# EasyEDA Pro project 产品板v3.1.eprj

# Schematic Schematic1

## Sheets
1 主控: Board Name: Board1; Create Date: 2025-03-01; Page Name: 主控; Project Name: 产品板v3.1; Schematic Name: Schematic1; Update Date: 2025-10-28; Company: 嘉立创EDA; Page Size: A4; Version: V1.0
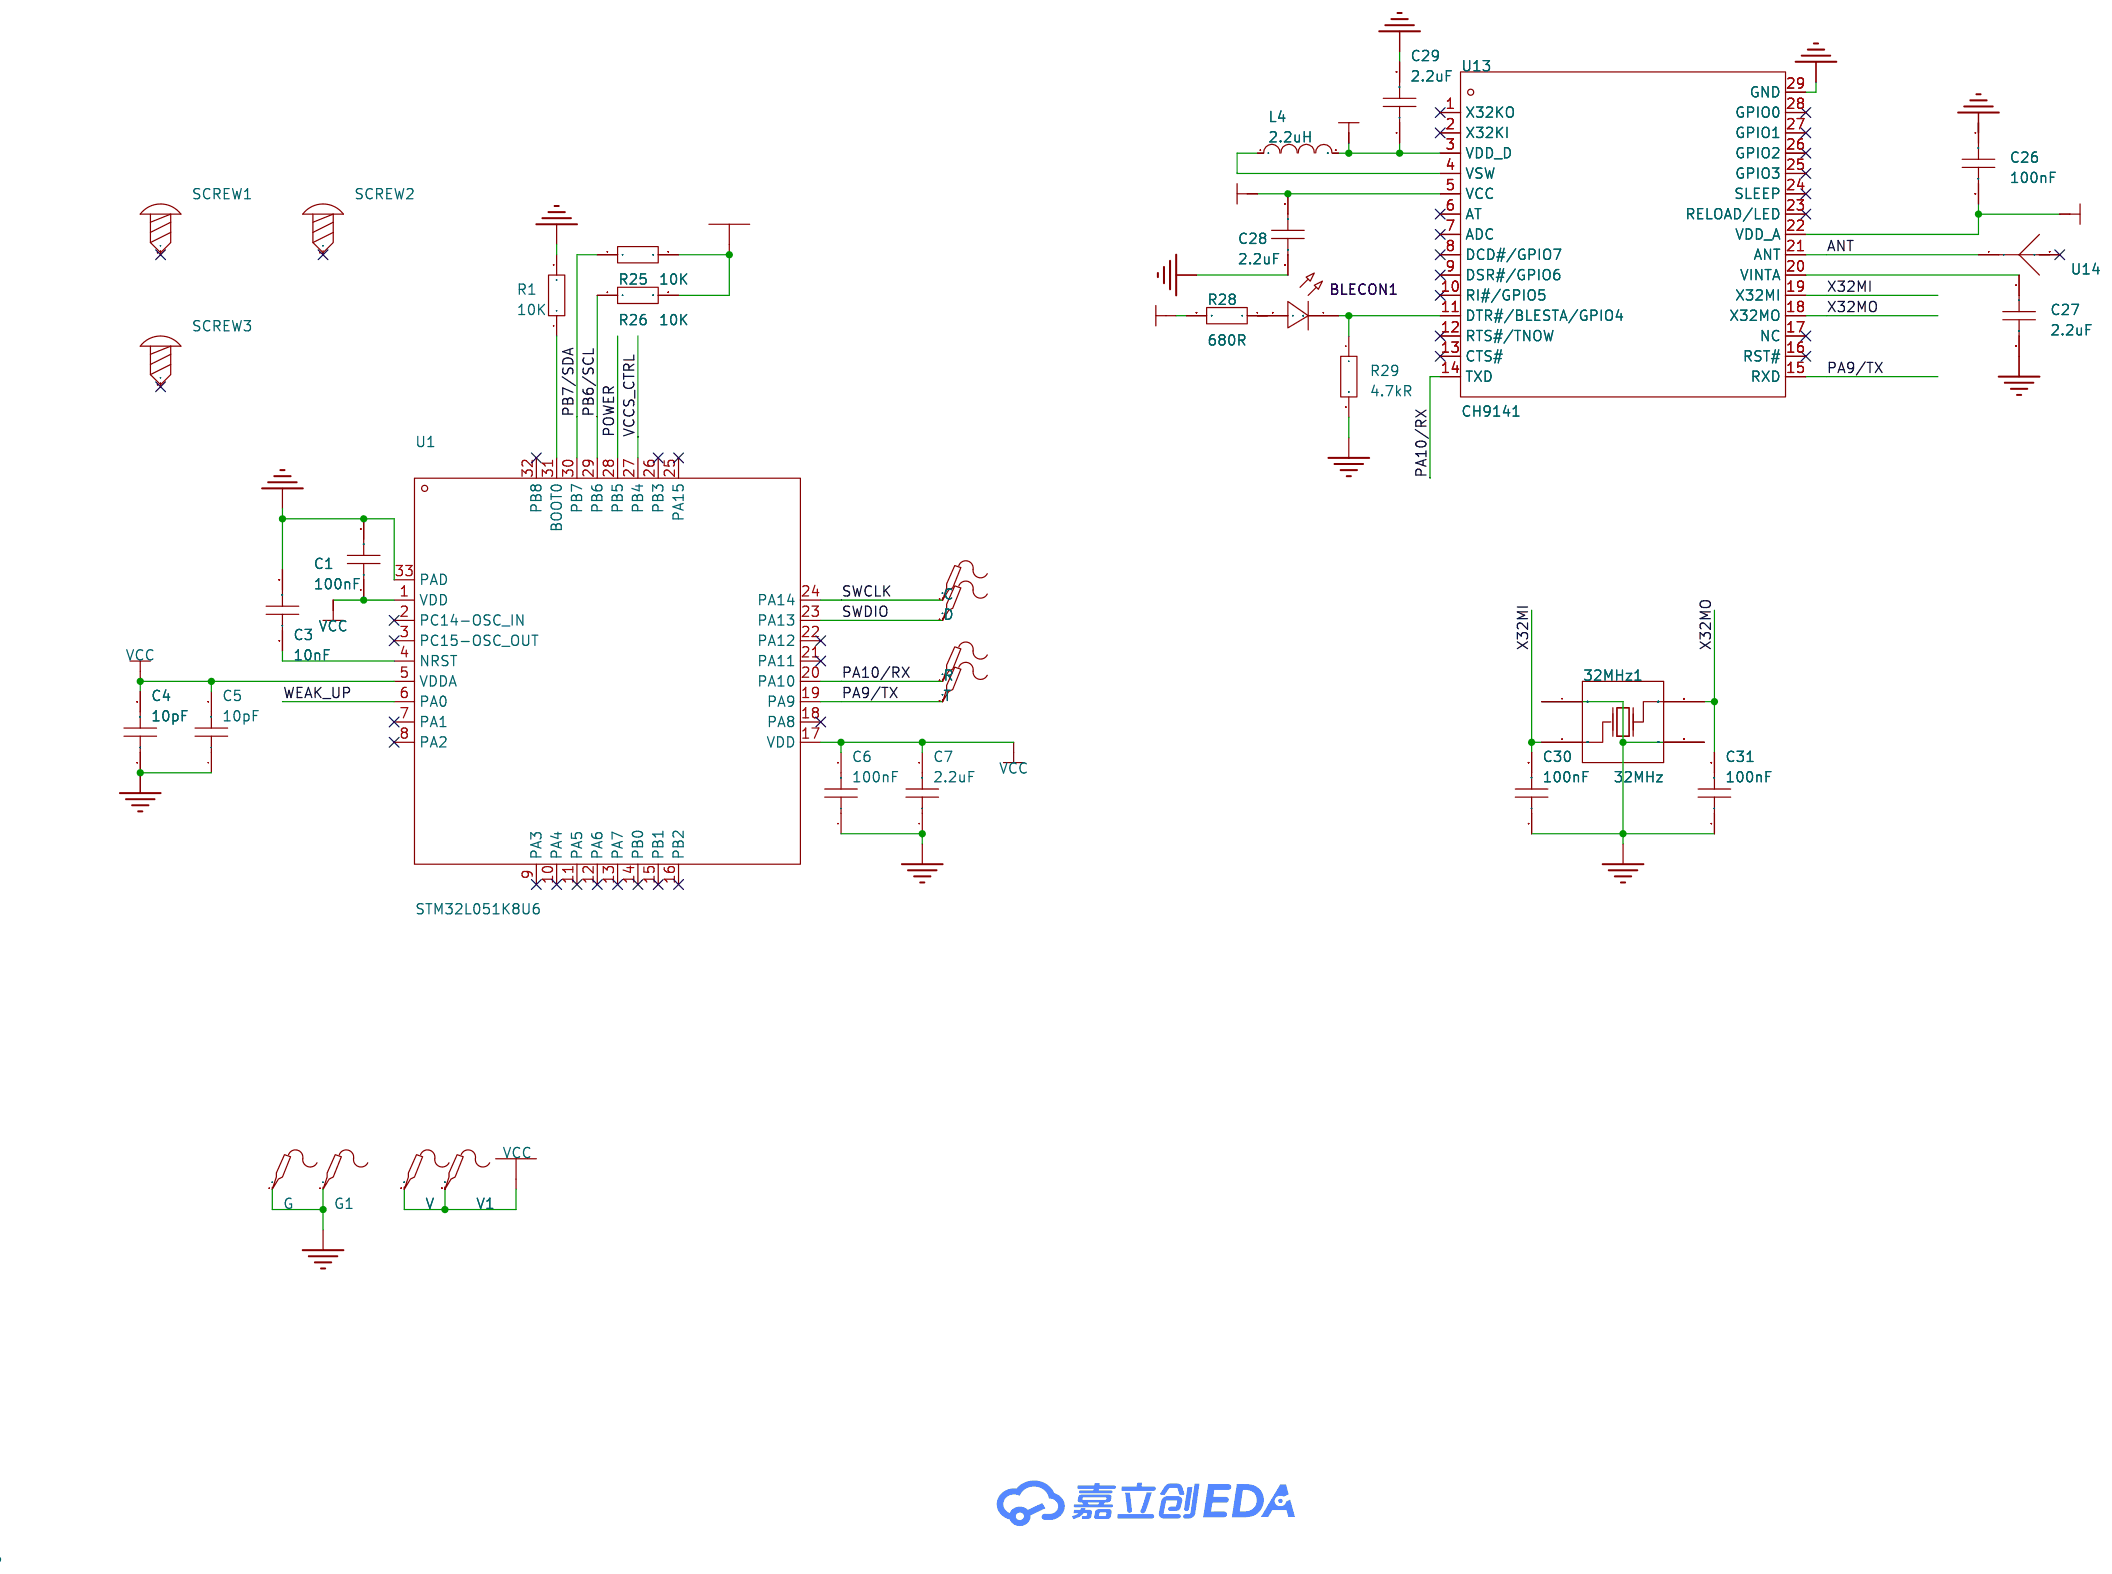
[diagram p0: 主控]
2 传感器: Page Name: 传感器; Project Name: 产品板v3.0; Update Date: 2025-08-19
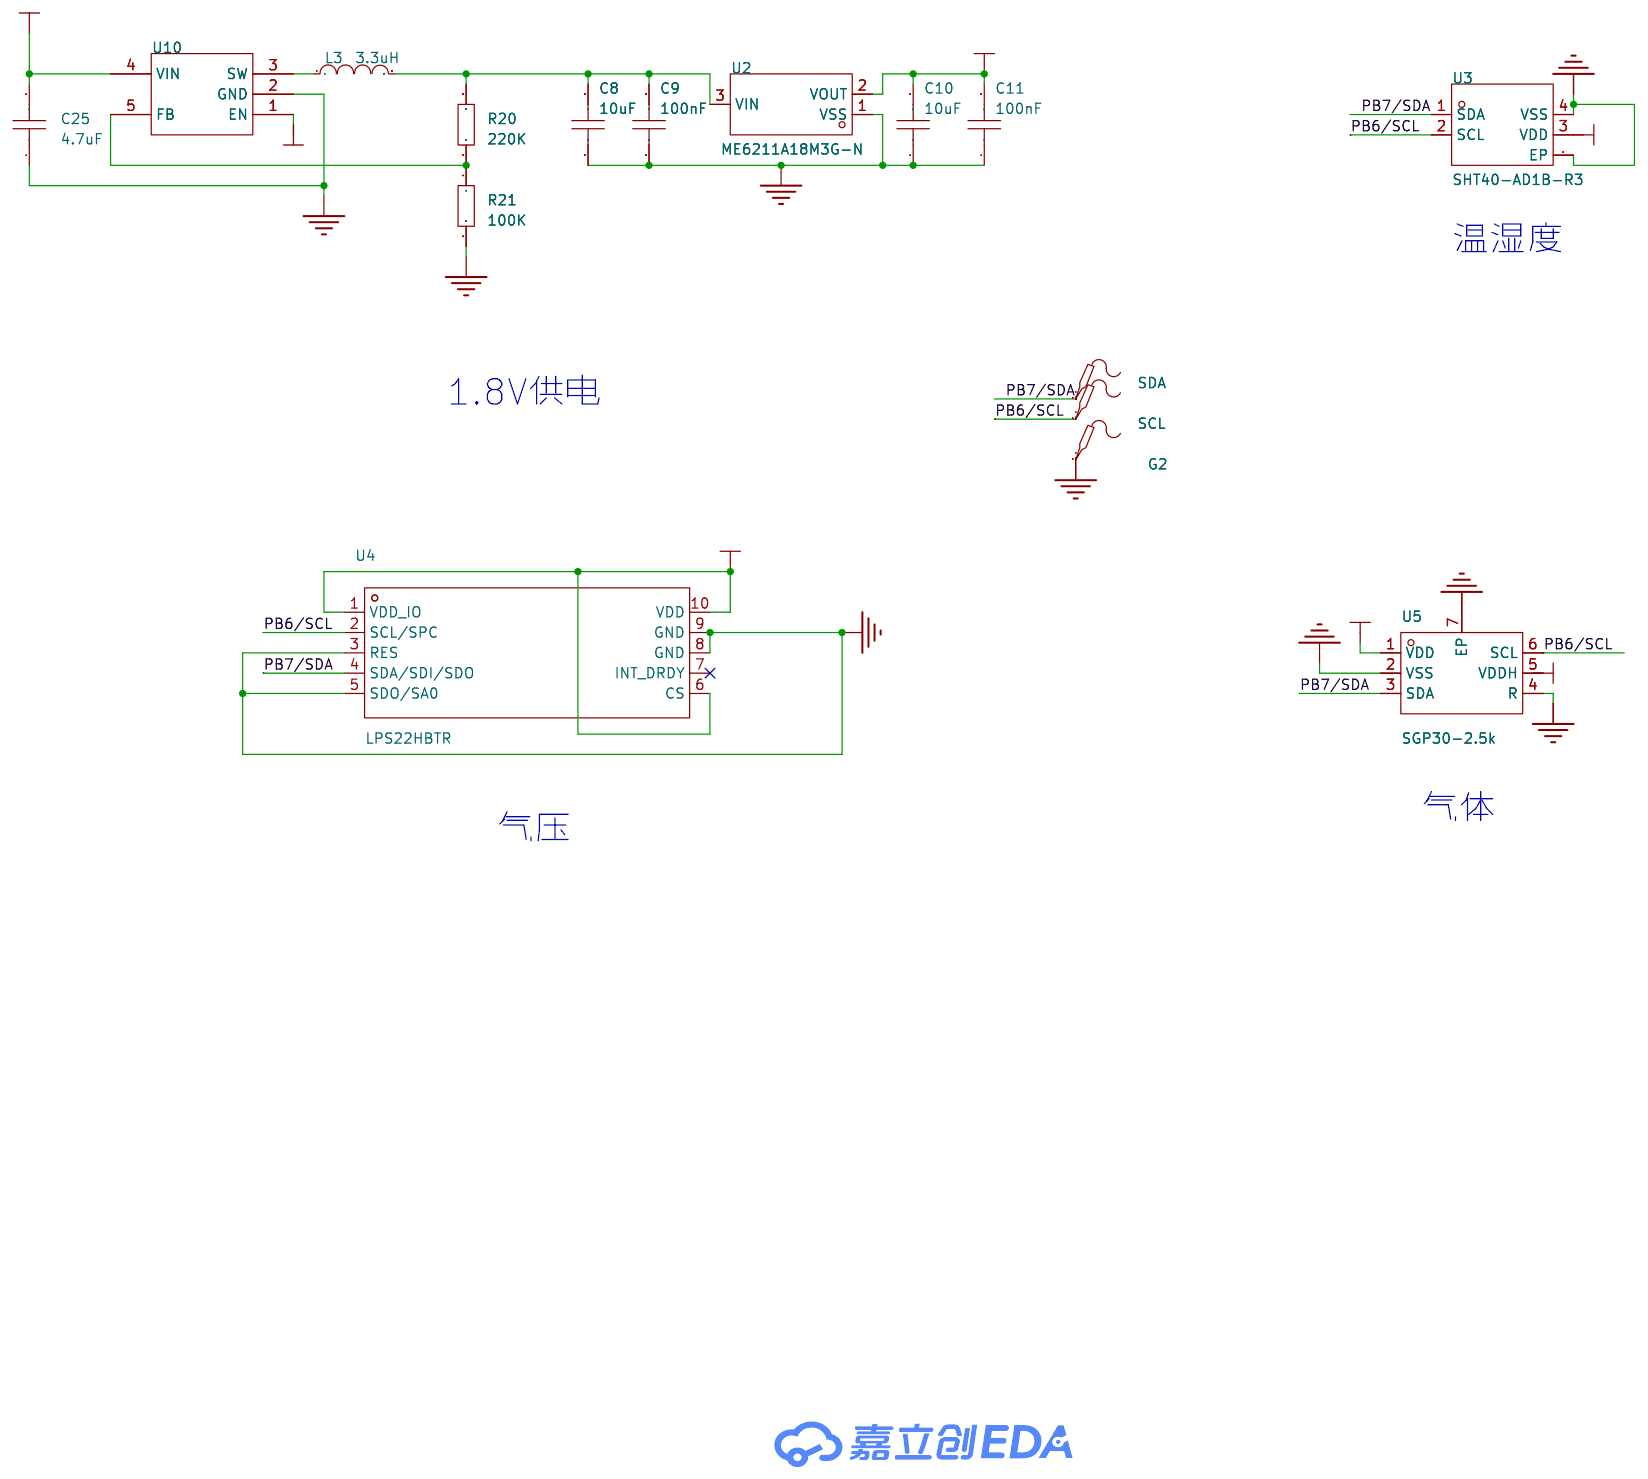
[diagram p1: 传感器]
3 电源: Page Name: 电源; Project Name: 产品板v3.0; Update Date: 2025-09-04
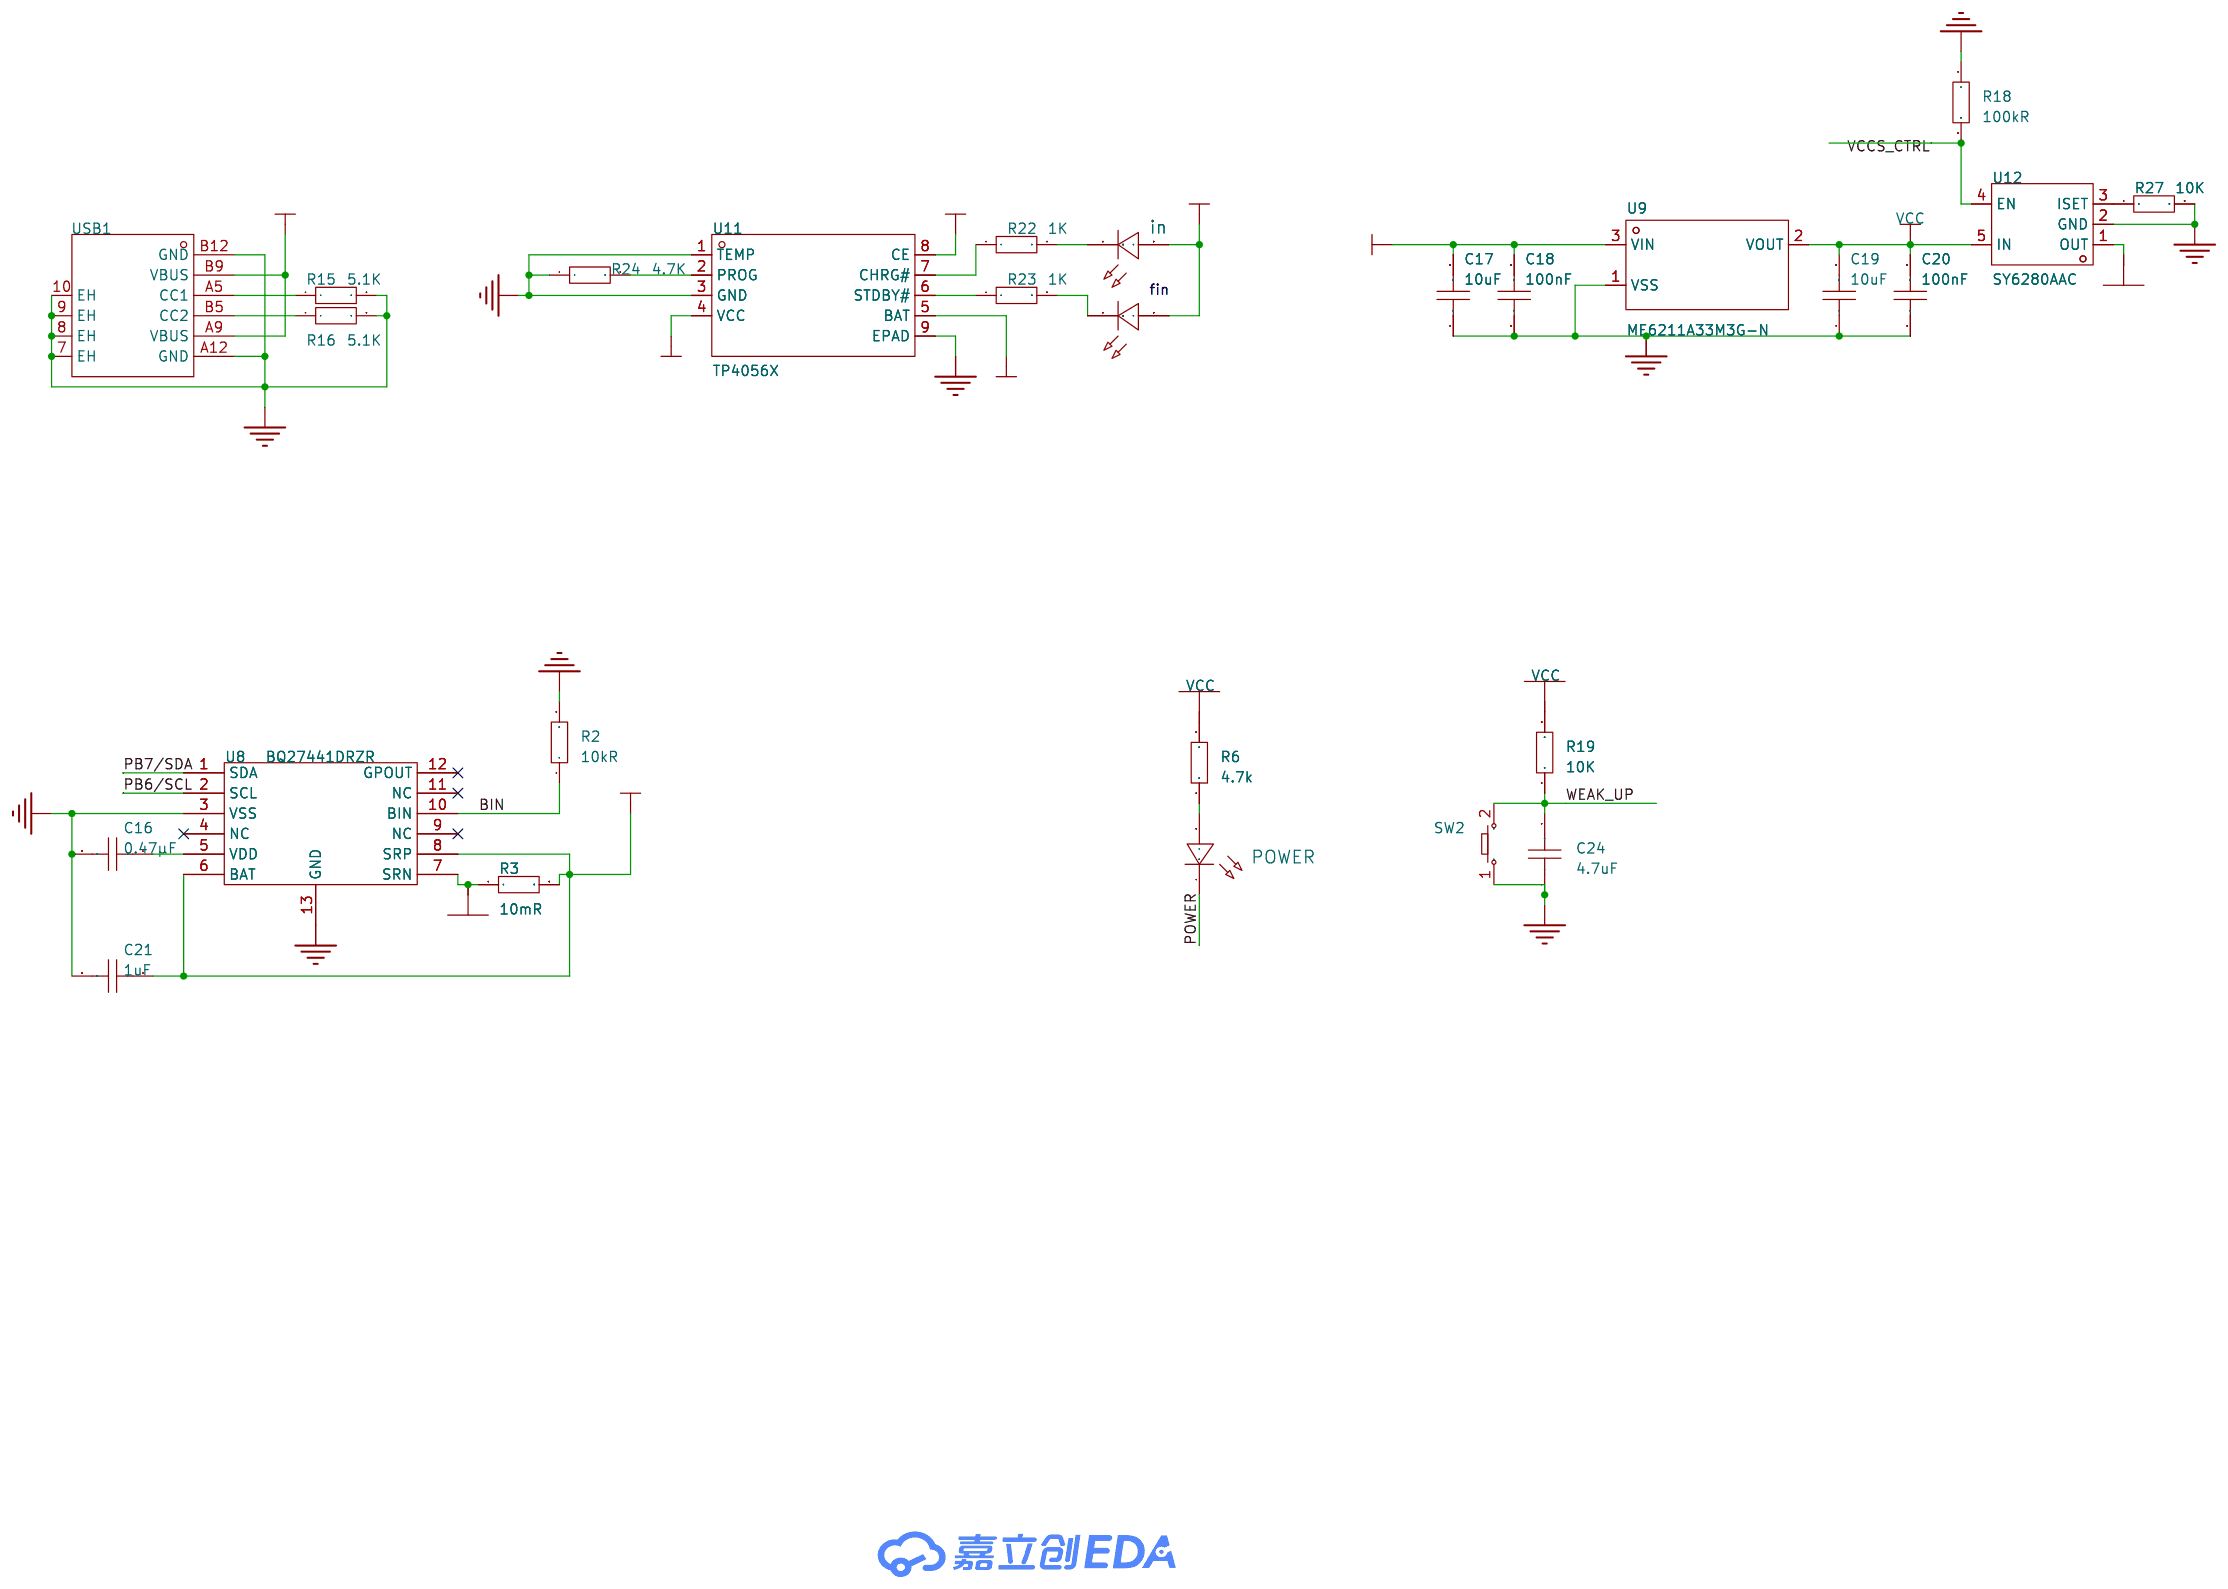
[diagram p2: 电源]

## Parts
sheet 主控
32MHz1  32MHz  [OSC-SMD_4P-L3.2-W2.5-BL]
BLECON1  -  [LED_0603]
C  -  [Test-Point-0.5mm]
C1  100nF  [C0603]
C3  10nF  [C0603]
C4  10pF  [C0603]
C5  10pF  [C0603]
C6  100nF  [C0603]
C7  2.2uF  [C0603]
C26  100nF  [C0603]
C27  2.2uF  [C0603]
C28  2.2uF  [C0603]
C29  2.2uF  [C0603]
C30  100nF  [C0603]
C31  100nF  [C0603]
D  -  [Test-Point-0.5mm]
G  -  [Test-Point-0.5mm]
G1  -  [Test-Point-0.5mm]
L4  2.2uH  [L0603]
R  -  [Test-Point-0.5mm]
R1  10K  [R0603]
R25  10K  [R0603]
R26  10K  [R0603]
R28  680R  [R0603]
R29  4.7kR  [R0603]
SCREW1  -  [M2螺丝]
SCREW2  -  [M2螺丝]
SCREW3  -  [M2螺丝]
T  -  [Test-Point-0.5mm]
U1  STM32L051K8U6  [UFQFPN-32_L5.0-W5.0-P0.50-BL-EP]
U13  CH9141  [qfn-28_l4.0-w4.0-p0.40-bl-ep2.7]
U14  -  [SMD，3.5x1.8]
V  -  [Test-Point-0.5mm]
V1  -  [Test-Point-0.5mm]
sheet 传感器
C8  10uF  [C0603]
C9  100nF  [C0603]
C10  10uF  [C0603]
C11  100nF  [C0603]
C25  4.7uF  [C0603]
G2  -  [Test-Point-0.5mm]
L3  3.3uH  [IND-SMD_L2.5-W2.0_SWPA2520]
R20  220K  [R0603]
R21  100K  [R0603]
SCL  -  [Test-Point-0.5mm]
SDA  -  [Test-Point-0.5mm]
U2  ME6211A18M3G-N  [SOT-23-3_L3.0-W1.7-P0.95-LS2.9-BR]
U3  SHT40-AD1B-R3  [DFN-4_L1.5-W1.5-P0.8-TL-EP]
U4  LPS22HBTR  [HLGA-10L_LPS22HBTR]
U5  SGP30-2.5k  [DFN-6_L2.5-W2.5-P0.8-BL-EP]
U10  -  [SOT-23-5_L2.9-W1.6-P0.95-LS2.8-TL]
sheet 电源
C16  0.47μF  [C0603]
C17  10uF  [C0603]
C18  100nF  [C0603]
C19  10uF  [C0603]
C20  100nF  [C0603]
C21  1uF  [C0603]
C24  4.7uF  [C0603]
fin  -  [LED_0603]
in  -  [LED_0603]
POWER  -  [LED_0603]
R2  10kR  [R0603]
R3  10mR  [R0805]
R6  4.7k  [R0603]
R15  5.1K  [R0603]
R16  5.1K  [R0603]
R18  100kR  [R0603]
R19  10K  [R0603]
R22  1K  [R0603]
R23  1K  [R0603]
R24  4.7K  [R0603]
R27  10K  [R0603]
SW2  -  [Key_SMD_3.6x6.1x2.5]
U8  BQ27441DRZR  [VSON-12]
U9  ME6211A33M3G-N  [SOT-23-3_L2.9-W1.6-P1.90-LS2.8-BR]
U11  TP4056X  [SOP-8_L4.9-W3.9-P1.27-LS6.0-BL-EP]
U12  SY6280AAC  [SOT-23-5_L3.0-W1.7-P0.95-LS2.8-BR]
USB1  -  [USB_ TYPE-C-6P]

## Library data of the parts
32MHz1 = X322532MMB4SI: 晶振类型:贴片晶振;频率:32MHz;常温频差:±10ppm;外接负载电容:10pF;频率稳定度(全温):±20ppm;; LCSC Part Name: 32MHz ±10ppm 10pF; Supplier Part: C113671; Manufacturer: YXC(扬兴晶振); Supplier Footprint: SMD3225-4P; JLCPCB Part Class: 扩展库; Datasheet: https://atta.szlcsc.com/upload/public/pdf/source/20240329/19D5F850207469550BEB00D7DFEDBC7A.pdf; Supplier: LCSC; Crystal Type: 贴片晶振; Normal temperature Frequency Tolerance: ±10ppm; External load capacitor: 10pF; Frequency Stability(Full temperature range): ±20ppm; Operating Temperature: -40℃~+85℃
BLECON1 = LED_0603-B: Supplier Footprint: 0603
C D G G1 G2 R SCL SDA T V V1 = Test-Point
C1 C3-C11 C16-C21 C24-C31 = CAP_0603: Supplier Footprint: 0603
L4 = L_0603
R1-R3 R6 R15 R16 R18-R29 = Res_0603: Supplier Footprint: 0603
SCREW1-SCREW3 = M2螺丝: Supplier Footprint: 插件
U1 = STM32L051K8U6: LCSC Part Name: 超低功耗Arm Cortex-M0+ MCU，具有64-KB Flash存储器和32 MHz CPU; Supplier Part: C94770; Manufacturer: ST(意法半导体); Supplier Footprint: UFQFPN-32(5x5); JLCPCB Part Class: 扩展库; Datasheet: https://atta.szlcsc.com/upload/public/pdf/source/20170810/C124724_1502335304342879861.pdf; Supplier: LCSC; CPU Core: ARM-M系列; CPU Maximum Speed: 32MHz; Program Storage Size: 64KB; Program Memory Type: FLASH; Number of I/O: 27; ADC (Bit): 12bit; Low Voltage Detection Threshold: 1.65V~3.6V
U13 = CH9141: Supplier Part: C2693433; Manufacturer: WCH(南京沁恒); Supplier Footprint: QFN-28-EP(4x4); JLCPCB Part Class: 扩展库; Datasheet: https://atta.szlcsc.com/upload/public/pdf/source/20210823/CE48D281B91EFE2028F80F60FB7FD3DE.pdf; Supplier: LCSC
U14 = T3518
L3 = SWPA252012S2R2MT: LCSC Part Name: 2.2uH ±20% 1.25A 216mΩ; Supplier Part: C23894; Manufacturer: Sunlord(顺络); Supplier Footprint: SMD; JLCPCB Part Class: Extended Part; Datasheet: https://atta.szlcsc.com/upload/public/pdf/source/20210916/AC798BA7E846B7D0B6818F45CD84DB0B.pdf; Supplier: LCSC; Tolerance: ±20%; Rated Current: 1.25A; DC Resistance (DCR): 216mΩ
U2 = ME6211A18M3G-N: 输出类型:固定;最大输入电压:6V;输出电压:1.8V;最大输出电流:300mA;电源纹波抑制比(PSRR):70dB;输出极性:正极;; LCSC Part Name: 输入6V 输出1.8V 300mA; Supplier Part: C236677; Manufacturer: MICRONE(南京微盟); Supplier Footprint: SOT-23; JLCPCB Part Class: 扩展库; Datasheet: https://atta.szlcsc.com/upload/public/pdf/source/20180801/C94042_8FDAFF138ADDED65E3D077205E9A8C17.pdf; Supplier: LCSC; Output Type: 固定; Maximum Input Voltage: 6V; Output Voltage: 1.8V; MAX Output Current: 300mA; Power Supply Rejection Ratio (PSRR): 70dB; Dropout Voltage: 400mV@(200mA); Output Polarity: 正极; Number of Outputs: 1
U3 = SHT40-AD1B-R3: 3.000.353; LCSC Part Name: 3.000.353; Supplier Part: C2848306; Manufacturer: Sensirion(瑞士盛思锐); Supplier Footprint: DFN-4-EP(1.5x1.5); JLCPCB Part Class: 扩展库; Datasheet: https://atta.szlcsc.com/upload/public/pdf/source/20210720/C2848306_34971E33C77B50764797513792751601.pdf; Supplier: LCSC
U4 = LPS22HBTR: Supplier Part: C94049; Manufacturer: ST(意法半导体); Supplier Footprint: HLGA-10L; JLCPCB Part Class: Extended Part; Datasheet: https://atta.szlcsc.com/upload/public/pdf/source/20170908/C94049_1504870171328958154.pdf; Supplier: LCSC
U5 = SGP30-2.5k: 气体类型:空气质量;精度:±10%;; LCSC Part Name: 空气质量传感器 停产; Supplier Part: C514454; Manufacturer: Sensirion(瑞士盛思锐); Supplier Footprint: DFN-6-EP(2.5x2.5); JLCPCB Part Class: 扩展库; Datasheet: https://atta.szlcsc.com/upload/public/pdf/source/20200415/C514454_3F36C180A79C1D2558414BFDFD1B5CA0.pdf; Supplier: LCSC; Type: 空气质量; Resolution: ±10%; Operating Temperature: -40℃~+85℃
U10 = TLV62569DBVR
fin = LED_0603-G: Supplier Footprint: 0603
in POWER = LED_0603-R: Supplier Footprint: 0603
SW2 = Key_SMD_3.6x6.1x2.5: Supplier Footprint: SMD
U8 = BQ27441DRZR
U9 = ME6211A33M3G-N: LCSC Part Name: 输入6V 输出3.3V 500mA; Supplier Part: C168807; Manufacturer: MICRONE(南京微盟); Supplier Footprint: SOT-23; JLCPCB Part Class: 扩展库; Datasheet: https://atta.szlcsc.com/upload/public/pdf/source/20180224/C168807_15194366627921363679.pdf; Supplier: LCSC; Output Type: 固定; Maximum Input Voltage: 6V; Output Voltage: 3.3V; MAX Output Current: 500mA; Power Supply Rejection Ratio (PSRR): 70dB; Dropout Voltage: 260mV@(200mA); Output Polarity: 正极; Number of Outputs: 1
U11 = TP4056X_C191323: Supplier Part: C191323; Manufacturer: TOPPOWER(南京拓微); Supplier Footprint: SOP-8EP_150mil; JLCPCB Part Class: Extended Part; Datasheet: https://atta.szlcsc.com/upload/public/pdf/source/20180424/C191323_1370BE5C4DD73DE4435E0781559DEFAC.pdf; Supplier: LCSC
U12 = SY6280AAC_C55136: Supplier Part: C55136; Manufacturer: 矽力杰silergy; Supplier Footprint: SOT-23-5; JLCPCB Part Class: Extended Part; Datasheet: https://atta.szlcsc.com/upload/public/pdf/source/20161108/1478586372822.pdf; Supplier: LCSC
USB1 = USB_ Type-C-6P: Supplier Footprint: SMD

## Nets
1.8V: C10.2 C11.2 U2.2(VOUT) U5.1(VDD) U5.5(VDDH)
GND: 32MHz1.2(GND) 32MHz1.4(GND) C1.2 C3.2 C4.1 C5.1 C6.1 C7.1 C8.1 C9.1 C10.1 C11.1 C16.2 C17.1 C18.1 C19.1 C20.1 C21.2 C24.1 C25.1 C26.1 C27.2 C28.2 C29.2 C30.1 C31.1 G.1 G1.1 G2.1 R1.2 R2.2 R15.2 R16.2 R18.1 R21.2 R24.1 R27.2 R29.2 SW2.1 U1.33(PAD) U2.1(VSS) U3.4(VSS) U3.5(EP) U4.3(RES) U4.5(SDO/SA0) U4.8(GND) U4.9(GND) U5.2(VSS) U5.4(R) U5.7(EP) U8.3(VSS) U8.13(GND) U9.1(VSS) U10.2(GND) U11.1(TEMP) U11.3(GND) U11.9(EPAD) U12.2(GND) U13.29(GND) USB1.7(EH) USB1.8(EH) USB1.9(EH) USB1.10(EH) USB1.A12(GND) USB1.B12(GND)
VBAT: C17.2 C18.2 C21.1 R3.2 U8.6(BAT) U8.8(SRP) U9.3(VIN) U11.5(BAT)
VCC: C1.1 C4.2 C5.2 C6.2 C7.2 C19.2 C20.2 R6.2 R19.2 U1.1(VDD) U1.5(VDDA) U1.17(VDD) U9.2(VOUT) U12.5(IN) V.1 V1.1
VCCS: C25.2 C26.2 C28.1 C29.1 L4.2 R25.2 R26.2 R28.2 U3.3(VDD) U4.1(VDD_IO) U4.6(CS) U4.10(VDD) U10.1(EN) U10.4(VIN) U12.1(OUT) U13.3(VDD_D) U13.5(VCC) U13.22(VDD_A)
VCCS_CTRL: R18.2 U1.27(PB4) U12.4(EN)
VIN: fin.2(A) in.2(A) U11.4(VCC) U11.8(CE) USB1.A9(VBUS) USB1.B9(VBUS)
ANT: U13.21(ANT) U14.1
BAT: R3.1 U8.7(SRN)
BIN: R2.1 U8.10(BIN)
PA9/TX: T.1 U1.19(PA9) U13.15(RXD)
PA10/RX: R.1 U1.20(PA10) U13.14(TXD)
PB6/SCL: R26.1 SCL.1 U1.29(PB6) U3.2(SCL) U4.2(SCL/SPC) U5.6(SCL) U8.2(SCL)
PB7/SDA: R25.1 SDA.1 U1.30(PB7) U3.1(SDA) U4.4(SDA/SDI/SDO) U5.3(SDA) U8.1(SDA)
POWER: POWER.1(C) U1.28(PB5)
SWCLK: C.1 U1.24(PA14)
SWDIO: D.1 U1.23(PA13)
WEAK_UP: C24.2 R19.1 SW2.2 U1.6(PA0)
X32MI: 32MHz1.1(OSC1) C30.2 U13.19(X32MI)
X32MO: 32MHz1.3(OSC2) C31.2 U13.18(X32MO)
$1N3980: R1.1 U1.31(BOOT0)
$1N4062: C3.1 U1.4(NRST)
$1N10064: C27.1 U13.20(VINTA)
$1N10069: BLECON1.1(C) R29.1 U13.11(DTR#/BLESTA/GPIO4)
$1N10070: BLECON1.2(A) R28.1
$1N10072: L4.1 U13.4(VSW)
$2N515: C8.2 C9.2 L3.2 R20.2 U2.3(VIN)
$2N3285: L3.1 U10.3(SW)
$2N3498: R20.1 R21.1 U10.5(FB)
$4N923: C16.1 U8.5(VDD)
$4N3284: POWER.2(A) R6.1
$4N4249: R15.1 USB1.A5(CC1)
$4N4253: R16.1 USB1.B5(CC2)
$4N8702: R23.1 U11.6(STDBY#)
$4N8728: R22.1 U11.7(CHRG#)
$4N8813: in.1(C) R22.2
$4N8818: fin.1(C) R23.2
$4N8965: R24.2 U11.2(PROG)
$4N10697: R27.1 U12.3(ISET)

Not connected (* = marked no-connect by the designer): SCREW1 1*; SCREW2 1*; SCREW3 1*; U1 2(PC14-OSC_IN)* 3(PC15-OSC_OUT)* 7(PA1)* 8(PA2)* 9(PA3)* 10(PA4)* 11(PA5)* 12(PA6)* 13(PA7)* 14(PB0)* 15(PB1)* 16(PB2)* 18(PA8)* 21(PA11)* 22(PA12)* 25(PA15)* 26(PB3)* 32(PB8)*; U4 7(INT_DRDY)*; U8 4(NC)* 9(NC)* 11(NC)* 12(GPOUT)*; U13 1(X32KO)* 2(X32KI)* 6(AT)* 7(ADC)* 8(DCD#/GPIO7)* 9(DSR#/GPIO6)* 10(RI#/GPIO5)* 12(RTS#/TNOW)* 13(CTS#)* 16(RST#)* 17(NC)* 23(RELOAD/LED)* 24(SLEEP)* 25(GPIO3)* 26(GPIO2)* 27(GPIO1)* 28(GPIO0)*; U14 2*

## Notes on the sheets
sheet 2
- 温湿度
- 1.8V供电
- 气体
- 气压

# Board 主控
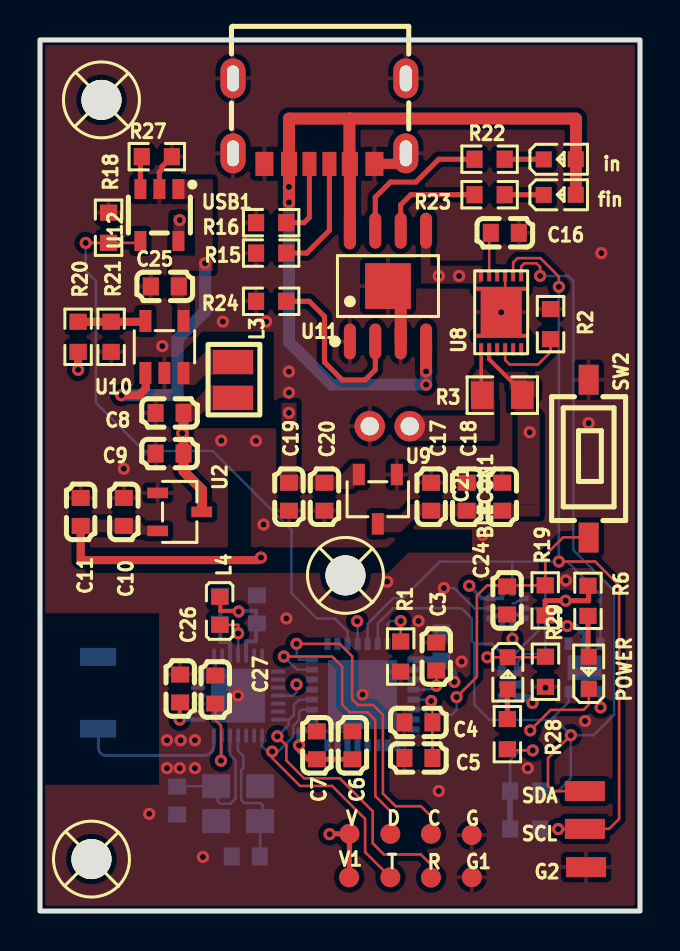
[diagram p3: board, top side]
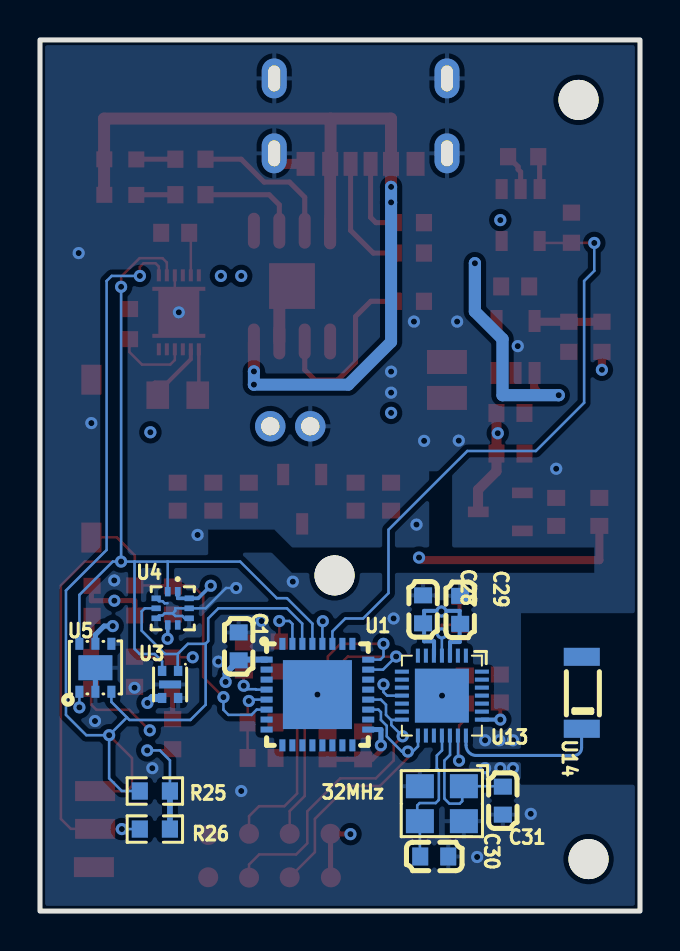
[diagram p4: board, bottom side, seen from below]

Outline 30 x 43.6 mm; copper layers: Top Layer, 内层2, Inner1, Bottom Layer. Coordinates in mm from the lower left corner of the outline.
Outline path: rectangle 0,43.6 30,0
Stack: Top Layer 0.035mm 外层铜厚1oz / Dielectric1 0.2104mm 7628 RC49% 8.6mil / 内层2 0.0152mm 内层铜厚 / Dielectric2 1.065mm 1.1mm H/HOZ Copper / Inner1 0.0152mm 内层铜厚 / Dielectric3 0.2104mm 7628 RC49% 8.6mil / Bottom Layer 0.035mm 外层铜厚1oz

## Design rules (mm)
net X32MI: DP1
net X32MO: DP1
template: 自定义配置
spacing copperThickness1oz (default): track to track 0.102, other pairs 0.152 to 0.3
spacing copperThickness2oz: track to track 0.203, other pairs 0.152 to 0.3
spacing RF: track to track 0.254, other pairs 0.254 to 0.3
track width copperThickness1oz (default): min 0.127, default 0.127, max 2.54
track width copperThickness2oz: min 0.203, default 0.254, max 2.54
differential pair differentialPair (default): width min 0.127, default 0.127, max 2.54; gap min 0.152, default 0.152
via viaSize (default): diameter min 0.5, default 0.61, max 10; hole min 0.3, default 0.305, max 6.299

## Placement (name value [footprint] x y rotation side)
32MHz  32MHz  [OSC-SMD_4P-L3.2-W2.5-BL]  9.91 5.37 0 bottom
BLECON1  -  [LED_0603]  23.39 11.85 270 top
C  -  [Test-Point-0.5mm]  19.55 3.87 0 top
C1  100nF  [C0603]  20.07 13.25 90 bottom
C3  10nF  [C0603]  19.81 12.74 90 top
C4  10pF  [C0603]  18.92 9.44 0 top
C5  10pF  [C0603]  18.92 7.66 0 top
C6  100nF  [C0603]  15.62 8.29 270 top
C7  2.2uF  [C0603]  13.84 8.29 270 top
C8  10uF  [C0603]  6.48 24.93 0 top
C9  100nF  [C0603]  6.48 22.9 0 top
C10  10uF  [C0603]  4.19 19.98 270 top
C11  100nF  [C0603]  2.03 19.98 270 top
C16  0.47μF  [C0603]  23.24 33.95 0 top
C17  10uF  [C0603]  19.56 20.74 270 top
C18  100nF  [C0603]  21.34 20.74 270 top
C19  10uF  [C0603]  12.45 20.74 90 top
C20  100nF  [C0603]  14.22 20.74 90 top
C21  1uF  [C0603]  23.11 20.74 90 top
C24  4.7uF  [C0603]  23.35 15.55 90 top
C25  4.7uF  [C0603]  6.24 31.27 0 top
C26  100nF  [C0603]  7.01 11.14 270 top
C27  2.2uF  [C0603]  8.76 11.09 90 top
C28  2.2uF  [C0603]  10.85 15.1 90 bottom
C29  2.2uF  [C0603]  8.99 15.08 90 bottom
C30  100nF  [C0603]  6.86 5.53 90 bottom
C31  100nF  [C0603]  10.29 2.73 0 bottom
D  -  [Test-Point-0.5mm]  17.52 3.87 0 top
fin  -  [LED_0603]  26.03 35.85 0 top
G  -  [Test-Point-0.5mm]  21.59 3.81 0 top
G1  -  [Test-Point-0.5mm]  21.59 1.69 0 top
G2  -  [Test-Point-0.5mm#2]  27.3 2.2 0 top
in  -  [LED_0603]  26.03 37.63 0 top
L3  3.3uH  [IND-SMD_L2.5-W2.0_SWPA2520]  9.65 26.58 270 top
L4  2.2uH  [L0603]  8.99 15.02 90 top
NOREF  -  [Pad_e68]  16.49 24.27 0 top
NOREF#2  -  [Pad_e70]  18.49 24.27 0 top
POWER  -  [LED_0603]  27.43 11.98 90 top
R  -  [Test-Point-0.5mm]  19.55 1.67 0 top
R1  10K  [R0603]  18.03 12.74 270 top
R2  10kR  [R0603]  25.53 29.38 90 top
R3  10mR  [R0805]  23.11 25.82 0 top
R6  4.7k  [R0603]  27.4 15.53 90 top
R15  5.1K  [R0603]  11.56 32.93 180 top
R16  5.1K  [R0603]  11.56 34.46 180 top
R18  100kR  [R0603]  3.43 34.2 270 top
R19  10K  [R0603]  25.26 15.55 270 top
R20  220K  [R0603]  1.91 28.74 270 top
R21  100K  [R0603]  3.56 28.74 270 top
R22  1K  [R0603]  22.48 37.63 0 top
R23  1K  [R0603]  22.48 35.85 0 top
R24  4.7K  [R0603]  11.56 30.52 0 top
R25  10K  [R0603]  24.26 6.01 180 bottom
R26  10K  [R0603]  24.26 4.1 180 bottom
R27  10K  [R0603]  5.84 37.76 0 top
R28  680R  [R0603]  23.37 8.85 270 top
R29  4.7kR  [R0603]  25.27 11.98 270 top
SCL  -  [Test-Point-0.5mm#2]  27.24 4.11 0 top
SCREW1  -  [M2螺丝]  2.57 2.6 0 top
SCREW2  -  [M2螺丝]  3.07 40.6 0 top
SCREW3  -  [M2螺丝]  15.27 16.8 0 top
SDA  -  [Test-Point-0.5mm#2]  27.24 6 0 top
SW2  -  [Key_SMD_3.6x6.1x2.5]  27.43 22.64 270 top
T  -  [Test-Point-0.5mm]  17.52 1.69 0 top
U1  STM32L051K8U6  [UFQFPN-32_L5.0-W5.0-P0.50-BL-EP]  16.13 10.83 270 bottom
U2  ME6211A18M3G-N  [SOT-23-3_L3.0-W1.7-P0.95-LS2.9-BR]  6.98 19.98 180 top
U3  SHT40-AD1B-R3  [DFN-4_L1.5-W1.5-P0.8-TL-EP]  23.5 11.34 270 bottom
U4  LPS22HBTR  [HLGA-10L_LPS22HBTR]  23.37 15.15 270 bottom
U5  SGP30-2.5k  [DFN-6_L2.5-W2.5-P0.8-BL-EP]  27.23 12.18 180 bottom
U8  BQ27441DRZR  [VSON-12]  24.38 32.04 270 top
U9  ME6211A33M3G-N  [SOT-23-3_L2.9-W1.6-P1.90-LS2.8-BR]  16.89 20.61 90 top
U10  -  [SOT-23-5_L2.9-W1.6-P0.95-LS2.8-TL]  6.22 28.23 90 top
U11  TP4056X  [SOP-8_L4.9-W3.9-P1.27-LS6.0-BL-EP]  17.4 31.28 0 top
U12  SY6280AAC  [SOT-23-5_L3.0-W1.7-P0.95-LS2.8-BR]  5.97 34.84 90 top
U13  CH9141  [qfn-28_l4.0-w4.0-p0.40-bl-ep2.7]  9.91 10.78 0 bottom
U14  -  [SMD，3.5x1.8]  3.81 8.67 90 bottom
USB1  -  [USB_ TYPE-C-6P]  14.1 39.54 180 top
V  -  [Test-Point-0.5mm]  15.47 3.87 0 top
V1  -  [Test-Point-0.5mm]  15.46 1.68 0 top

## Footprints (pads in the part's own frame, mm; a bottom-side part is the same pattern mirrored in y, then rotated)
C0603
  rect 0.8x0.9 smd: 1(-0.7,0) 2(0.7,0)
DFN-4_L1.5-W1.5-P0.8-TL-EP
  rect 0.505x0.42 smd: 1(-0.677,0.4) 2(-0.677,-0.4) 3(0.677,-0.4) 4(0.677,0.4)
  rect 0.4x1.1 smd: 5(0,0)
DFN-6_L2.5-W2.5-P0.8-BL-EP
  rect 0.4x0.6 smd: 1(-0.8,-1.2) 2(0,-1.2) 3(0.8,-1.2) 4(0.8,1.2) 5(0,1.2) 6(-0.8,1.2)
  rect 1.7x1.25 smd: 7(0,0)
HLGA-10L_LPS22HBTR
  rect 0.465x0.28 smd: 1(-0.833,0.255) 2(-0.833,-0.245) 6(0.833,-0.245) 7(0.833,0.255)
  rect 0.28x0.465 smd: 3(-0.5,-0.828) 4(0,-0.828) 5(0.5,-0.828) 8(0.5,0.828) 9(0,0.828) 10(-0.5,0.828)
IND-SMD_L2.5-W2.0_SWPA2520
  rect 1.2x2 smd: 1(-0.9,0) 2(0.9,0)
Key_SMD_3.6x6.1x2.5
  rect 1.501x1.001 smd: 1(-3.95,0) 2(3.95,0)
L0603
  rect 0.8x0.864 smd: 1(-0.7,0) 2(0.7,0)
LED_0603
  rect 0.8x0.8 smd: 1(-0.851,-0.01) 2(0.75,-0.005)
M2螺丝
  round 2 hole 2: 1(0,0)
OSC-SMD_4P-L3.2-W2.5-BL
  rect 1.4x1.2 smd: 1(-1.1,-0.875) 2(1.1,-0.875) 3(1.1,0.875) 4(-1.1,0.875)
Pad_e68
  round 1.524 hole 0.914: 1(0,0)
Pad_e70
  round 1.524 hole 0.914: 2(0,0)
qfn-28_l4.0-w4.0-p0.40-bl-ep2.7
  rect 0.2x0.7 smd: 1(-1.2,-2) 2(-0.8,-2) 3(-0.4,-2) 4(-0.001,-2) 5(0.4,-2) 6(0.8,-2) 7(1.2,-2) 15(1.2,2) 16(0.8,2) 17(0.4,2) 18(0,2) 19(-0.4,2) 20(-0.8,2) 21(-1.2,2)
  rect 0.7x0.2 smd: 8(2,-1.2) 9(2,-0.8) 10(2,-0.4) 11(1.999,0) 12(2,0.4) 13(2,0.8) 14(2,1.2) 22(-2,1.2) 23(-2,0.8) 24(-2,0.4) 25(-2,0) 26(-2,-0.4) 27(-2,-0.8) 28(-2,-1.2)
  rect 2.7x2.7 smd: 29(0.001,0)
R0603
  rect 0.806x0.864 smd: 1(-0.753,0) 2(0.753,0)
R0805
  rect 1.133x1.377 smd: 1(-1,0) 2(1,0)
SMD，3.5x1.8
  rect 0.9x1.8 smd: 1(0.45,-0.9) 2(4.05,-0.9)
SOP-8_L4.9-W3.9-P1.27-LS6.0-BL-EP
  oval 0.6x1.8 smd: 1(-1.905,-2.772) 2(-0.635,-2.772) 3(0.635,-2.772) 4(1.905,-2.772) 5(1.905,2.772) 6(0.635,2.772) 7(-0.635,2.772) 8(-1.905,2.772)
  rect 2.29x2.29 smd: 9(0,0)
SOT-23-3_L2.9-W1.6-P1.90-LS2.8-BR
  rect 1.07x0.6 smd: 1(1.235,-0.95) 2(1.235,0.95) 3(-1.235,0)
SOT-23-3_L3.0-W1.7-P0.95-LS2.9-BR
  rect 1.038x0.532 smd: 1(1.101,-0.95) 2(1.101,0.95) 3(-1.101,0)
SOT-23-5_L2.9-W1.6-P0.95-LS2.8-TL
  rect 1.1x0.6 smd: 1(-1.3,0.95) 2(-1.3,0) 3(-1.3,-0.95) 4(1.3,-0.95) 5(1.3,0.95)
SOT-23-5_L3.0-W1.7-P0.95-LS2.8-BR
  rect 1x0.6 smd: 1(1.3,-0.95) 2(1.3,0) 3(1.3,0.95) 4(-1.3,0.95) 5(-1.3,-0.95)
Test-Point-0.5mm
  round 1 smd: 1(0,0)
Test-Point-0.5mm#2
  rect 2x1 smd: 1(0,0)
UFQFPN-32_L5.0-W5.0-P0.50-BL-EP
  rect 0.3x0.6 smd: 1(-1.75,-2.54) 2(-1.25,-2.54) 3(-0.75,-2.54) 4(-0.25,-2.54) 5(0.25,-2.54) 6(0.75,-2.54) 7(1.25,-2.54) 8(1.75,-2.54) 17(1.75,2.54) 18(1.25,2.54) 19(0.75,2.54) 20(0.25,2.54) 21(-0.25,2.54) 22(-0.75,2.54) 23(-1.25,2.54) 24(-1.75,2.54)
  rect 0.6x0.3 smd: 9(2.54,-1.75) 10(2.54,-1.25) 11(2.54,-0.75) 12(2.54,-0.25) 13(2.54,0.25) 14(2.54,0.75) 15(2.54,1.25) 16(2.54,1.75) 25(-2.54,1.75) 26(-2.54,1.25) 27(-2.54,0.75) 28(-2.54,0.25) 29(-2.54,-0.25) 30(-2.54,-0.75) 31(-2.54,-1.25) 32(-2.54,-1.75)
  rect 3.45x3.45 smd: 33(0,0)
USB_ TYPE-C-6P
  oval 1.25x2 hole 0.6x1.3: 7(-4.193,1.611) 8(4.447,1.611) 9(-4.193,-2.139) 10(4.447,-2.139)
  rect 0.7x1.2 smd: A5(-0.373,2.139) B5(0.627,2.139)
  rect 0.8x1.2 smd: A9(1.647,2.139) B9(-1.393,2.139)
  rect 0.9x1.2 smd: A12(2.877,2.139) B12(-2.623,2.139)
VSON-12
  rect 0.6x0.2 smd: 1(0.224,-0.325) 2(0.224,-0.725) 3(0.224,-1.125) 4(0.224,-1.525) 5(0.224,-1.925) 6(0.224,-2.325) 7(3.926,-2.325) 8(3.926,-1.925) 9(3.926,-1.525) 10(3.926,-1.125) 11(3.926,-0.725) 12(3.926,-0.325)
  custom 2.55x2.65 smd: 13(2.075,-1.325)

## Nets
As in the schematic, except:
GND: 32MHz.2 32MHz.4 C1.2 C3.2 C4.1 C5.1 C6.1 C7.1 C8.1 C9.1 C10.1 C11.1 C16.2 C17.1 C18.1 C19.1 C20.1 C21.2 C24.1 C25.1 C26.1 C27.2 C28.2 C29.2 C30.1 C31.1 G.1 G1.1 G2.1 NOREF.1 R1.2 R2.2 R15.2 R16.2 R18.1 R21.2 R24.1 R27.2 R29.2 SW2.1 U1.33 U2.1 U3.4 U3.5 U4.3 U4.5 U4.8 U4.9 U5.2 U5.4 U5.7 U8.3 U8.13 U9.1 U10.2 U11.1 U11.3 U11.9 U12.2 U13.29 USB1.7 USB1.8 USB1.9 USB1.10 USB1.A12 USB1.B12
BAT: NOREF#2.2 R3.1 U8.7
X32MI: 32MHz.1 C30.2 U13.19
X32MO: 32MHz.3 C31.2 U13.18

Pads without a net: SCREW1 1; SCREW2 1; SCREW3 1; U1 2 3 7 8 9 10 11 12 13 14 15 16 18 21 22 25 26 32; U4 7; U8 4 9 11 12; U13 1 2 6 7 8 9 10 12 13 16 17 23 24 25 26 27 28; U14 2

## Via types
v1: diameter 0.61, hole 0.305, Top Layer to Bottom Layer, 79 vias

## Routing (per net, layer and track width the routed paths; a pad name or vN(x,y) marks a point on that pad's centre or on a via; arc(x,y) is an arc through that point)
1.8V: length 39
  Top Layer w0.406: C11.2 2.03,17.56 10.92,17.56 v1(11.05,17.69)
  Inner1 w0.406: v1(28.03,10.19) 28.03,13.41 27.18,14.26 v1(26.36,14.26) 23.24,17.38 23.24,20.36 13.72,20.36 v1(11.05,17.69)
  Bottom Layer w0.127: U5.1 v1(28.03,10.19)
  Bottom Layer w0.254: v1(26.36,14.26) 26.8,14.26 27.23,13.83 U5.5
GND: length 16.6
  Top Layer w0.127: U8.3 23.26,29.66 23.06,29.46
  Top Layer w0.254: R27.2 6.1,37.26 6.1,37.12 5.97,37 U12.2 ; 17.9,30.78 17.51,30.39 17.4,30.39
  Top Layer w0.508: USB1.7 17.76,37.4 16.72,37.4
  Top Layer w0.6: 17.9,30.78 18.03,30.65 U11.3
  Bottom Layer w0.127: v1(20.19,16.17) 20.7,16.17 21.72,15.15 U4.9 23.24,15.15 23.24,15.02 23.37,14.9 ; U4.8 22.77,14.65 22.88,14.77 23.24,14.77 23.37,14.9 ; U4.3 24.05,15.51 23.87,15.51 23.77,15.41 23.62,15.41 ; 23.37,14.9 23.77,14.9 23.87,14.8 24.05,14.8 U4.5
  Bottom Layer w0.254: U5.2 U5.7
  vias: v1(4.19,22.14) v1(5.46,4.86) v1(6.11,28.28) v1(6.35,8.55) v1(6.35,7.15) v1(6.98,7.15) v1(7.03,8.55) v1(7.75,8.55) v1(7.75,7.15) v1(8.14,2.71) v1(9.06,23.55) v1(9.14,29.5) v1(9.9,10.78) v1(10.79,23.53) v1(11.18,19.34) v1(11.3,29.5) v1(12.32,14.64) v1(12.45,27) v1(12.45,25.95) v1(16.13,10.83) v1(17.36,16.49) v1(18.92,14.52) v1(19.94,6.01) v1(21.08,12.48) v1(22.12,18.82) v1(23.06,29.97) v1(24.38,7.15) v1(25.27,11.18) v1(26.29,16.55) v1(27.25,9.51) v1(27.43,24.42) v1(28.07,32.93)
VBAT: length 3.1
  Top Layer w0.201: 24.51,26.2 24.26,26.45 23.62,26.45 22.46,27.62 U8.8
  vias: v1(19.94,31.79) v1(20.95,31.79) v1(24.48,23.96)
VCC: length 99.9
  Top Layer w0.127: C5.2 C4.2 19.62,10.45 v1(19.56,10.51)
  Top Layer w0.254: v1(12.95,8.29) 12.95,8.04 13.4,7.59 C7.2 C6.2 ; R19.2 25.26,15.53 v1(26.28,15.53) 27.43,15.53 27.43,16.25 R6.2 ; v1(14.48,3.85) 14.5,3.87 V.1 15.47,1.7 V1.1
  Inner1 w0.6: v1(6.98,34.58) 7.75,34.58 8.76,33.57 14.39,33.57 14.39,24.93 v1(12.45,24.93) 12.45,21.25 24.26,21.25 24.26,17.44 26.16,15.53 v1(26.28,15.53) 27.18,15.53 28.79,13.92 28.79,8.17 27.01,6.39 22.22,6.39 22.22,11.47 v1(20.72,11.47) 19.96,12.23 18.29,12.23 17.84,11.78 17.84,10.51 ; v1(14.48,3.85) 13.72,3.85 12.95,4.61 v1(12.95,8.29) 12.95,9.82 17.14,9.82 17.84,10.51 ; 17.84,10.51 v1(19.56,10.51)
  Bottom Layer w0.127: U1.5 19.49,10.58 v1(19.56,10.51)
  Bottom Layer w0.254: U1.17 12.95,9.08 v1(12.95,8.29)
  Bottom Layer w0.299: v1(20.72,11.47) 20.72,11.89 C1.1 20.03,12.58 U1.1
VCCS: length 86.4
  Top Layer w0.127: v1(24.64,8.04) 24.63,8.05 23.37,8.05
  Top Layer w0.201: 9.02,15.72 9.02,15.02 9.81,15.02 ; v1(6.98,9.58) 6.98,10.26
  Top Layer w0.406: v1(4.06,25.82) 4.95,25.82 5.29,26.16 5.29,26.92
  Inner1 w0.6: 8.25,14.99 8.25,9.58 v1(6.98,9.58) ; 8.25,14.99 v1(8.25,32.42) ; 8.25,14.99 v1(9.93,14.99) 9.93,15.05 14.35,19.47 19.3,19.47 21.46,17.31 v1(21.46,16.28) 21.46,16.06 26.03,11.49 26.03,10.38 ; v1(24.64,8.04) 25.78,8.04 25.78,9.53 26.03,9.78 26.03,10.38 ; 26.03,10.38 25.99,10.42 v1(24.63,10.42)
  Bottom Layer w0.127: v1(24.64,8.04) 24,8.04 23.5,7.54 R25.2
  Bottom Layer w0.178: v1(21.46,16.28) 22.09,15.65 U4.10 23.11,15.65 23.11,15.66 U4.1 ; U4.6 23.61,13.64 v1(23.62,13.63)
  Bottom Layer w0.201: 9.5,12.53 9.5,13.46 9.02,13.46 9.02,13.47 9.02,15.02 9.81,15.02 ; 7.9,9.58 v1(6.98,9.58) ; 10.3,12.78 10.3,13.5 10.79,13.5 10.79,15.02 9.81,15.02
  Bottom Layer w0.284: R25.2 R26.2
  Bottom Layer w0.406: U3.3 24.38,10.66 v1(24.63,10.42)
  Bottom Layer w0.61: v1(8.25,32.42) 8.25,30.01 6.87,28.63 6.87,25.82 v1(4.06,25.82)
VCCS_CTRL: length 30.7
  Top Layer w0.127: v1(2.29,33.44) 4.83,33.44 4.89,33.51 4.95,33.51
  Bottom Layer w0.127: U1.27 15.38,14 14.73,14.64 13.84,14.64 12.57,15.91 12.57,19.09 8.64,23.03 5.21,23.03 2.79,25.44 2.79,31.53 2.29,32.04 v1(2.29,33.44)
VIN: length 46
  Top Layer w0.6: 26.83,36.11 26.8,36.14 26.8,39.66 15.47,39.66 ; 15.49,33.42 15.49,37.39 ; 15.47,39.66 15.47,37.41 15.49,37.4 ; 15.47,39.66 12.45,39.66 12.45,35.48 v1(12.45,35.47) ; U11.4 v1(19.3,27.01)
  Bottom Layer w0.6: 19.3,27.01 v1(19.3,26.35) 14.58,26.35 12.45,28.49 v1(12.45,35.47) v1(12.45,36.25)
ANT: length 7.5
  Bottom Layer w0.152: 8.7,8.78 8.7,8.29 arc(8.55,7.93) 8.19,7.79 3.3,7.79 arc(3.03,7.9) 2.92,8.17 2.92,8.86 arc(2.92,8.87) 2.91,8.87
BAT: length 1.8
  Top Layer w0.178: U8.7 22.06,26.33
BIN: length 3.8
  Top Layer w0.127: U8.10 23.26,27.58 23.49,27.35 24.9,27.35 25.53,27.98 R2.1
PA9/TX: length 14.2
  Top Layer w0.127: T.1 16.26,2.95 16.26,4.61 14.6,6.26 13,6.26 11.61,7.66 v1(11.61,7.98)
  Bottom Layer w0.127: 11.1,8.78 11.1,8.24 11.36,7.98 v1(11.61,7.98) 11.91,7.98 12.66,8.74 12.66,9.27 12.95,9.56 12.95,9.96 13.08,10.08 U1.19
PA10/RX: length 15.9
  Top Layer w0.127: v1(11.87,8.74) 12.32,8.29 12.32,7.53 13.21,6.64 14.99,6.64 16.64,4.99 16.64,3.39 17.19,2.83 19.04,2.83 19.55,2.32 R.1
  Bottom Layer w0.127: 12.45,9.56 12.43,9.55 12.43,9.31 v1(11.87,8.74) ; 12.45,9.56 11.92,9.56 11.9,9.58 ; 12.45,9.56 12.7,9.82 12.7,10.33 12.96,10.58 U1.20
PB6/SCL: length 62.1
  Top Layer w0.127: v1(25.94,17.49) 27.76,17.49 28.96,16.29 28.96,4.61 28.46,4.11 SCL.1 27.23,4.1 v1(25.91,4.1) ; U8.2 23.66,32.46 23.88,32.68 25.02,32.68 25.94,31.75 v1(25.94,31.24)
  Bottom Layer w0.127: 23.61,17.49 U4.2 ; 23.61,17.49 25.27,17.49 ; 23.61,17.49 19.99,17.49 18.16,15.66 17.65,15.66 16.38,14.39 U1.29 ; 25.27,17.49 25.27,13.12 25.02,12.87 24.26,12.87 23.89,12.5 U3.2 ; 25.27,17.49 v1(25.94,17.49) ; v1(25.94,17.49) 26.36,17.49 28.03,15.82 U5.6 ; v1(25.94,17.49) v1(25.94,31.24) ; R26.1 v1(25.91,4.1)
PB7/SDA: length 62.1
  Top Layer w0.127: v1(25.01,31.79) 25.01,32.24 24.82,32.42 24.23,32.42 24.06,32.26 U8.1 ; v1(26.54,8.8) 25.4,7.66 25.4,6.26 25.66,6 SDA.1
  Bottom Layer w0.127: R25.1 25.91,6.01 26.54,6.64 v1(26.54,8.8) ; v1(25.01,31.79) 26.42,31.79 26.67,31.53 26.67,18.07 28.7,16.04 28.7,9.82 27.69,8.8 v1(26.54,8.8) ; 23.11,12.87 23.75,12.87 24.92,14.03 24.92,15 24.76,15.15 U4.4 ; 23.11,12.87 22.61,13.37 21.73,13.37 21.72,13.39 ; 23.11,12.87 23.11,12.04 U3.1 ; 25.65,9.69 25.53,9.56 22.48,9.56 21.72,10.33 21.72,13.39 ; 25.65,9.69 26.43,10.47 U5.3 ; 25.65,9.69 v1(26.54,8.8) ; 21.72,13.39 21.59,13.51 21.59,14.64 21.08,15.15 17.65,15.15 16.89,14.39 16.89,13.39 U1.30
POWER: length 17.9
  Top Layer w0.127: v1(24.51,9.04) 25.54,10.07 27.18,10.07 27.44,10.34 POWER.1
  Inner1 w0.127: v1(15.86,14.51) 16.87,13.5 22.42,13.5 23.37,12.55 23.37,9.81 24.13,9.04 v1(24.51,9.04)
  Bottom Layer w0.127: U1.28 15.88,14.49 v1(15.86,14.51)
SWCLK: length 16.2
  Top Layer w0.127: C.1 19.55,4.75 19.05,5.25 17.78,5.25 17.14,5.88 17.14,9.82 16.65,10.31 15.91,10.31 15.9,10.33 15.88,10.33 15.62,10.58 15.62,10.61 15.61,10.62 15.61,12.75 14.99,13.37 v1(12.83,13.37)
  Bottom Layer w0.127: v1(12.83,13.37) 12.83,12.74 12.98,12.58 U1.24
SWDIO: length 14.7
  Top Layer w0.127: D.1 17.52,5 16.76,5.75 16.76,9.56 16.38,9.94 15.49,9.94 15.11,10.33 15.11,12.23 14.6,12.74 v1(12.19,12.74)
  Bottom Layer w0.127: v1(12.19,12.74) 12.85,12.08 U1.23
WEAK_UP: length 16.1
  Top Layer w0.127: v1(20.83,10.71) 21.84,11.72 21.84,15.79 22.35,16.29 25.25,16.29 R19.1 25.26,17.81 26.16,18.7 27.3,18.7
  Bottom Layer w0.127: v1(20.83,10.71) 20.83,10.07 20.57,9.82 19.43,9.82 19.16,10.08 U1.6
X32MI: length 7.1
  Bottom Layer w0.127: 9.5,8.78 9.5,7.81 9.78,7.53 9.78,5.63 9.52,5.37 9.02,5.37 8.89,5.5 8.89,6.25 6.91,6.25 6.86,6.2
X32MO: length 7.2
  Bottom Layer w0.127: 10.99,2.71 11.01,2.72 32MHz.3 11.14,4.63 11.14,5.28 11.02,5.4 10.22,5.4 10.06,5.56 10.06,7.05 10.16,7.15 10.16,7.78 9.9,8.04 9.9,8.78
$1N3980: length 2.7
  Top Layer w0.127: R1.1 v1(18.03,14.52)
  Bottom Layer w0.127: U1.31 17.38,14.37 17.53,14.52 v1(18.03,14.52)
$1N4062: length 2
  Top Layer w0.127: v1(19.82,11.28) 19.82,12.03 C3.1
  Bottom Layer w0.127: U1.4 19.19,11.08 19.22,11.1 19.64,11.1 v1(19.82,11.28)
$1N10064: length 4.3
  Top Layer w0.127: C27.1 8.76,9.56 9.05,9.28 v1(9.05,7.53)
  Bottom Layer w0.127: 9.1,8.78 9.1,7.58 v1(9.05,7.53)
$1N10069: length 14.8
  Top Layer w0.127: R29.1 25.24,12.7 BLECON1.1 v1(22.36,12.7)
  Inner1 w0.127: v1(22.36,12.7) 22.35,12.7 21.93,13.12 14.6,13.12 v1(12.83,11.34)
  Bottom Layer w0.127: 11.9,10.78 12.65,10.78 12.83,10.96 v1(12.83,11.34)
$1N10070: length 1.5
  Top Layer w0.254: 23.37,9.56 23.37,11.1 23.36,11.1
$1N10072: length 2.5
  Top Layer w0.127: L4.1 9.91,14.32 v1(9.91,13.9)
  Bottom Layer w0.127: v1(9.91,13.9) 9.91,12.79 U13.4
$2N515: length 13.9
  Top Layer w0.406: R20.2 v1(1.91,27.09)
  Top Layer w0.508: C8.2 C9.2 7.18,22.01 8.1,21.09 8.1,19.99 U2.3
  Inner1 w0.406: v1(1.91,27.09) 1.91,25.18 3.17,23.91 v1(7.11,23.91)
$2N3498: length 3.4
  Top Layer w0.406: R20.1 R21.1 5.27,29.49 5.29,29.52
$4N923: length 2.2
  Top Layer w0.127: 22.46,31.82 22.46,33.87 C16.1
$4N3284: length 2.1
  Top Layer w0.254: POWER.2 27.4,12.76 R6.1
$4N4249: length 6
  Top Layer w0.254: R15.1 13.33,32.93 14.47,34.07 14.47,37.4
$4N4253: length 3.9
  Top Layer w0.254: R16.1 13.21,34.46 13.47,34.72 13.47,37.4
$4N8702: length 5.2
  Top Layer w0.254: U11.6 18.03,35.34 18.54,35.85 21.72,35.85 21.72,35.86 R23.1
$4N8728: length 7.4
  Top Layer w0.254: U11.7 16.76,35.73 17.53,36.49 18.8,36.49 19.94,37.63 R22.1
$4N8813: length 2
  Top Layer w0.254: in.1 25.17,37.63 R22.2
$4N8818: length 2
  Top Layer w0.254: R23.2 25.17,35.85 fin.1
$4N8965: length 8.9
  Top Layer w0.254: R24.2 13.46,30.52 14.22,29.76 14.22,27.47 15.11,26.58 16.26,26.58 16.76,27.09 16.76,28.38
$4N10697: length 1.6
  Top Layer w0.254: U12.3 5.02,37.69 R27.1

## Copper pours and planes (outline as drawn; the poured copper is in the pictures)
1.8V on Top Layer: 1.65,19.6 4.57,19.6 4.57,18.96 1.65,18.96
1.8V on Top Layer: 3.81,19.6 6.35,19.6 6.35,18.83 3.81,18.83
GND on Top Layer: -3.18,46.14 36.7,46.14 36.7,-1.36 -3.18,-1.36
GND on Bottom Layer: -3.43,47.79 33.4,47.79 33.4,-3.01 -3.43,-3.01
GND on 内层2: 0.26,43.34 29.74,43.34 29.74,0.26 0.26,0.26
GND on Inner1: -5.59,48.68 33.4,48.68 33.4,-2.88 -5.59,-2.88
VBAT on Top Layer: 23.61,26.45 24.99,26.45 24.99,20.36 23.61,20.36
VBAT on Top Layer: 16.64,20.36 24.99,20.36 24.99,18.96 16.64,18.96
VBAT on Top Layer: 22.83,27.26 24.86,27.26 24.86,25.72 22.83,25.72
VBAT on Top Layer: 19.05,34.33 22.1,34.33 22.1,31.41 19.05,31.41
VBAT on Inner1: 19.05,31.79 25.02,31.79 25.02,23.53 19.05,23.53
VCC on Top Layer: 12.06,25.44 12.83,25.44 12.83,21.1 12.06,21.1
VCC on Top Layer: 12.06,22.39 16.13,22.39 16.13,21.12 12.06,21.12
VCC on Top Layer: 6.67,34.84 7.24,34.84 7.24,33.06 6.67,33.06
VCCS on Top Layer: 6.73,36.61 8.64,36.61 8.64,35.67 6.73,35.67
VCCS on Top Layer: 6.6,32.8 8.64,32.8 8.64,32.04 6.6,32.04
VCCS on Top Layer: 7.75,36.61 8.64,36.61 8.64,32.04 7.75,32.04
VCCS on Top Layer: 6.6,32.8 7.49,32.8 7.49,29.38 6.6,29.38
BAT on Top Layer: 18.49,25.85 22.73,25.85 22.73,23.53 18.49,23.53
BAT on Top Layer: 21.53,27.12 22.7,27.12 22.7,25.59 21.53,25.59
$2N515 on Top Layer: 6.86,26.33 10.67,26.33 10.67,24.55 6.86,24.55
$2N3285 on Top Layer: 6.98,28.11 10.67,28.11 10.67,26.33 6.98,26.33

Small or netless copper shapes (teardrops, artwork), in the pictures only: 19 on 内层2
